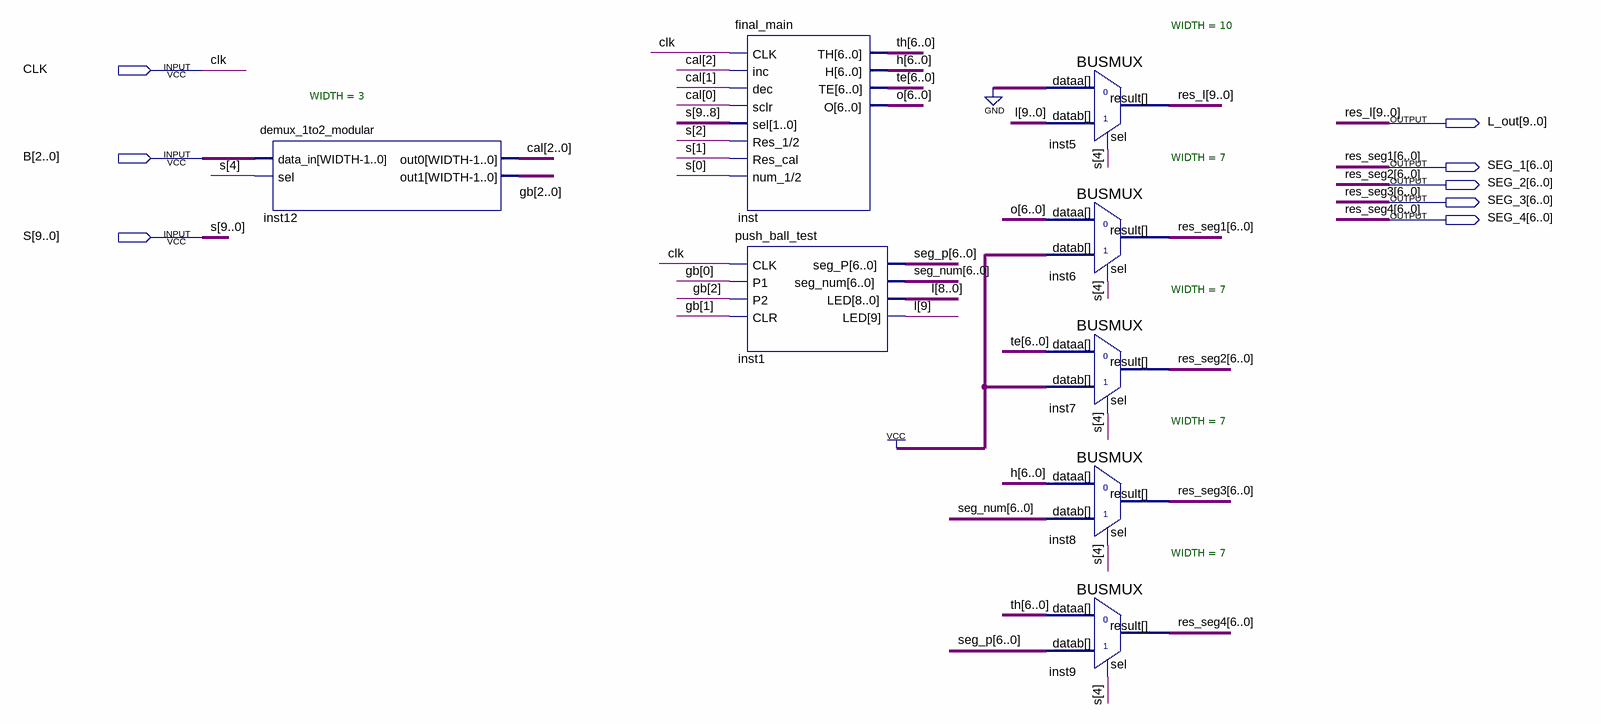
[diagram p0: schematic sheet]
// Quartus schematic final_final_pro_main.bdf as structural Verilog: 8 symbols, 8 pins
module final_final_pro_main (
  input  CLK,
  input  [2:0] B,
  input  [9:0] S,
  output [9:0] L_out,
  output [6:0] SEG_1,
  output [6:0] SEG_2,
  output [6:0] SEG_3,
  output [6:0] SEG_4
);

  wire [2:0] cal, gb;
  wire [6:0] h, o, seg_num, seg_p, te, th;
  wire [9:0] l;

  demux_1to2_modular #(.WIDTH(3)) inst12 (.data_in(B), .sel(S[4]), .out0(cal), .out1(gb));
  final_main inst (
    .CLK(CLK), .inc(cal[2]), .dec(cal[1]), .sclr(cal[0]), .sel(S[9:8]), .\Res_1/2 (S[2]), .Res_cal(S[1]),
    .\num_1/2 (S[0]), .TH(th), .H(h), .TE(te), .O(o));
  push_ball_test inst1 (.CLK(CLK), .P1(gb[0]), .P2(gb[2]), .CLR(gb[1]), .seg_P(seg_p), .seg_num(seg_num), .LED(l));
  BUSMUX #(.WIDTH(10)) inst5 (.datab(l), .sel(S[4]), .dataa({10{1'b0}}), .result(L_out));
  BUSMUX #(.WIDTH(7)) inst6 (.datab({7{1'b1}}), .sel(S[4]), .dataa(o), .result(SEG_1));
  BUSMUX #(.WIDTH(7)) inst7 (.datab({7{1'b1}}), .sel(S[4]), .dataa(te), .result(SEG_2));
  BUSMUX #(.WIDTH(7)) inst8 (.datab(seg_num), .sel(S[4]), .dataa(h), .result(SEG_3));
  BUSMUX #(.WIDTH(7)) inst9 (.datab(seg_p), .sel(S[4]), .dataa(th), .result(SEG_4));

  // Other names for the same wires on the sheet: res_l[9:0] = L_out; res_seg1[6:0] = SEG_1; res_seg2[6:0] = SEG_2;
  //   res_seg3[6:0] = SEG_3; res_seg4[6:0] = SEG_4
endmodule
